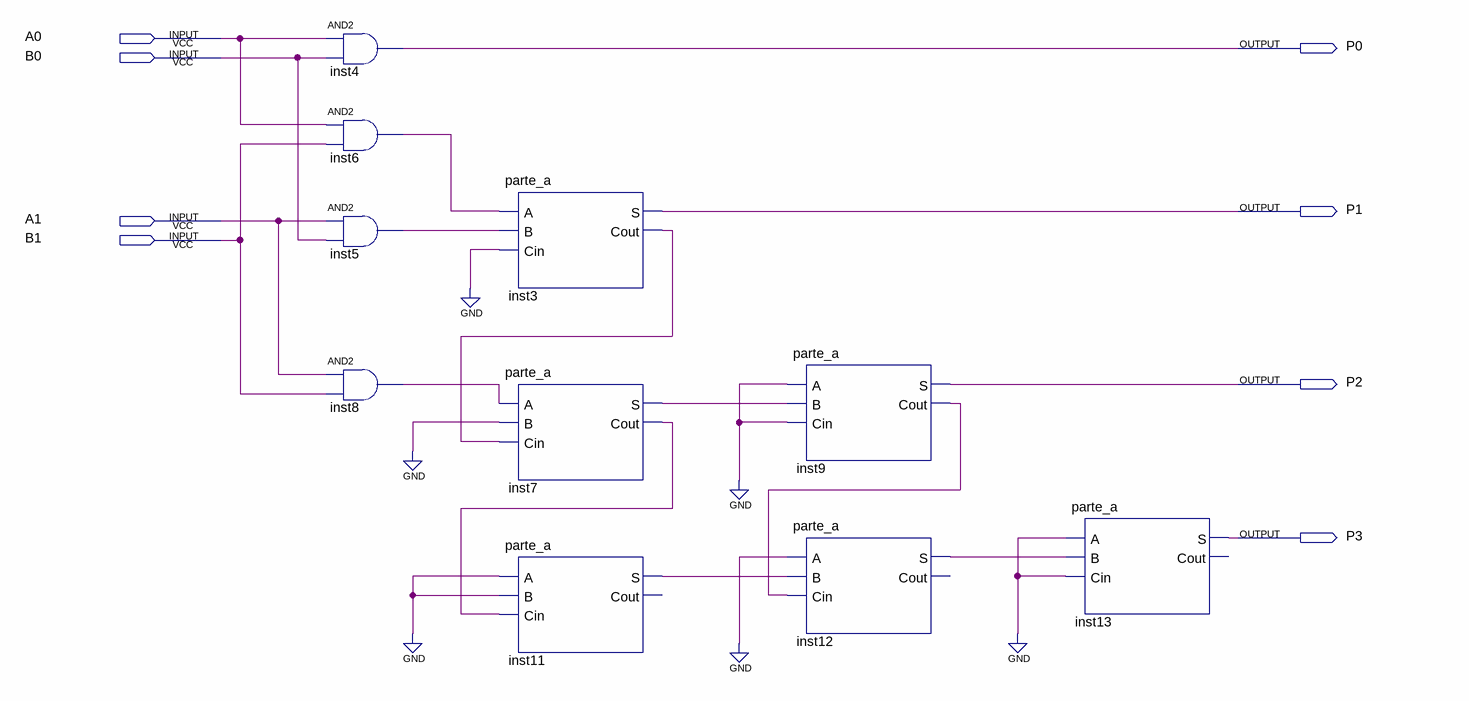
[diagram p0: schematic sheet]
// Quartus schematic parte_b.bdf as structural Verilog: 10 symbols, 8 pins
module parte_b (
  input  A0,
  input  B0,
  input  A1,
  input  B1,
  output P0,
  output P1,
  output P2,
  output P3
);

  wire inst3_cout, inst5_out, inst6_out, inst7_cout, inst7_s, inst8_out, inst9_cout, inst11_s, inst12_s;

  and inst4 (P0, A0, B0);
  and inst6 (inst6_out, A0, B1);
  and inst5 (inst5_out, A1, B0);
  and inst8 (inst8_out, A1, B1);
  parte_a inst3 (.A(inst6_out), .B(inst5_out), .Cin(1'b0), .S(P1), .Cout(inst3_cout));
  parte_a inst7 (.A(inst8_out), .B(1'b0), .Cin(inst3_cout), .S(inst7_s), .Cout(inst7_cout));
  parte_a inst11 (.A(1'b0), .B(1'b0), .Cin(inst7_cout), .S(inst11_s));  // open: Cout
  parte_a inst9 (.A(1'b0), .B(inst7_s), .Cin(1'b0), .S(P2), .Cout(inst9_cout));
  parte_a inst12 (.A(1'b0), .B(inst11_s), .Cin(inst9_cout), .S(inst12_s));  // open: Cout
  parte_a inst13 (.A(1'b0), .B(inst12_s), .Cin(1'b0), .S(P3));  // open: Cout
endmodule
